# EAGLE design Zio 9DOF IMU LSM9DS1 (EAGLE 8.4.1)
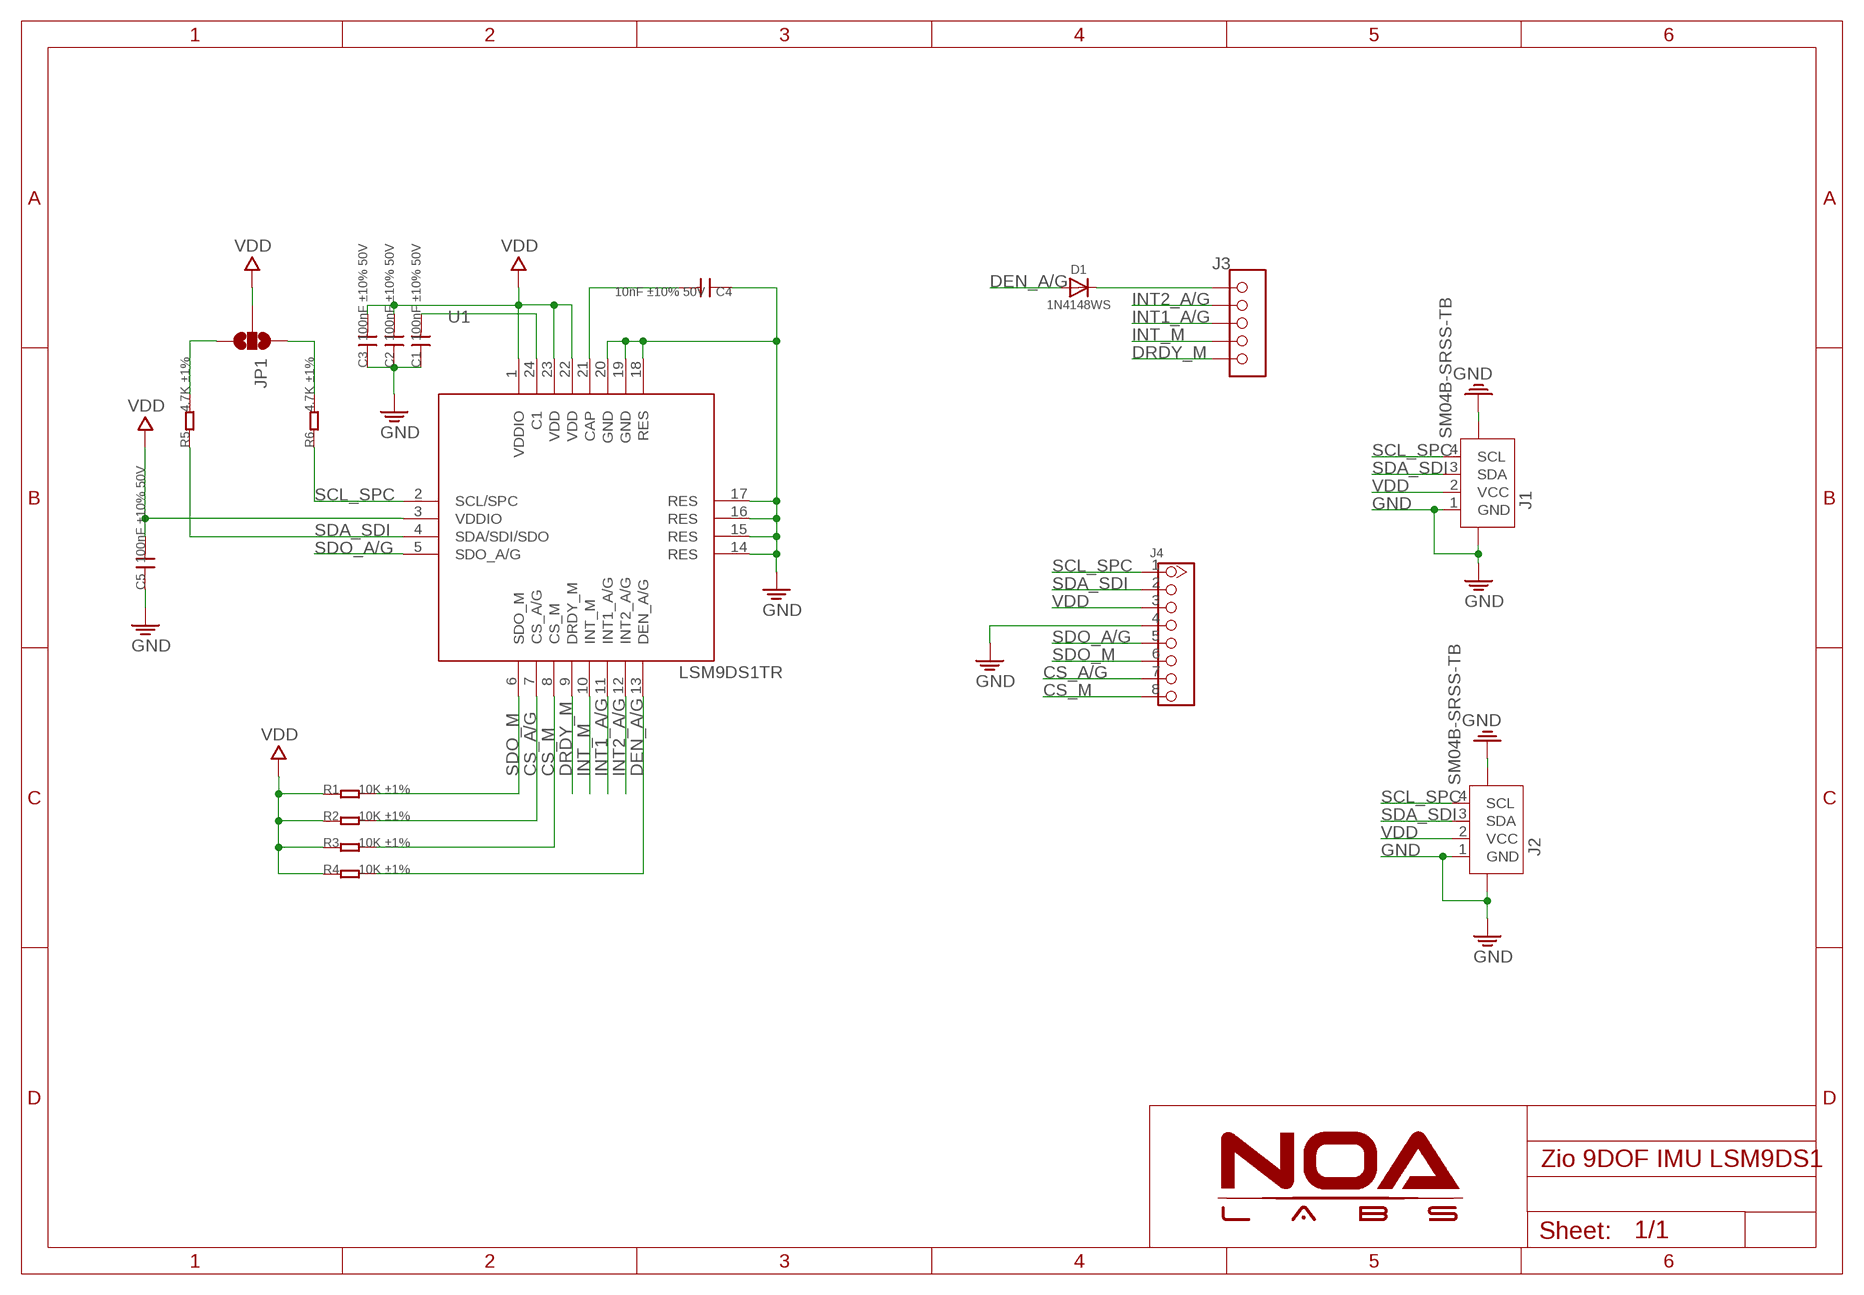
[diagram p0: schematic, sheet 1]

## Parts
C1  100nF ±10% 50V  C-0402  [0402]
C2  100nF ±10% 50V  C-0402  [0402]
C3  100nF ±10% 50V  C-0402  [0402]
C4  10nF ±10% 50V  C-0402  [0402]
C5  100nF ±10% 50V  C-0402  [0402]
D1  1N4148WS  DIODESOD-323  [SOD-323]
J1  SM04B-SRSS-TB  JST-SH-4P-1.0  [JST-SH-4P]
J2  SM04B-SRSS-TB  JST-SH-4P-1.0  [JST-SH-4P]
J3  HEADER-5P-2.54  [5P-2.54]
J4  HEADER-8P-2.54  [8P-2.54]
JP1  JUMPER-SMT_3_2-NC_PASTE_NOCREM  [SMT-JUMPER_3_2-NC_PASTE_SILK_NOCREM]
R1  10K ±1%  R-0402  [0402]
R2  10K ±1%  R-0402  [0402]
R3  10K ±1%  R-0402  [0402]
R4  10K ±1%  R-0402  [0402]
R5  4.7K ±1%  R-0402  [0402]
R6  4.7K ±1%  R-0402  [0402]
U1  LSM9DS1TR  LSM9DS1  [LGA24]

## Nets
CS_A/G: J4.7 R2.2 U1.7(CS_A/G)
CS_M: J4.8 R3.2 U1.8(CS_M)
DEN_A/G: D1.A R4.2 U1.13(DEN_A/G)
DRDY_M: J3.5 U1.9(DRDY_M)
GND: C1.1 C2.1 C3.1 C4.1 C5.1 J1.1(GND) J1.NC1 J1.NC2 J2.1(GND) J2.NC1 J2.NC2 J4.4 U1.14(RES) U1.15(RES) U1.16(RES) U1.17(RES) U1.18(RES) U1.19(GND) U1.20(GND)
INT1_A/G: J3.3 U1.11(INT1_A/G)
INT2_A/G: J3.2 U1.12(INT2_A/G)
INT_M: J3.4 U1.10(INT_M)
N$1: C1.2 U1.24(C1)
N$2: JP1.3 R5.2
N$3: JP1.1 R6.2
N$4: C4.2 U1.21(CAP)
N$5: D1.C J3.1
SCL_SPC: J1.4(SCL) J2.4(SCL) J4.1 R6.1 U1.2(SCL/SPC)
SDA_SDI: J1.3(SDA) J2.3(SDA) J4.2 R5.1 U1.4(SDA/SDI/SDO)
SDO_A/G: J4.5 U1.5(SDO_A/G)
SDO_M: J4.6 R1.2 U1.6(SDO_M)
VDD: C2.2 C3.2 C5.2 J1.2(VCC) J2.2(VCC) J4.3 JP1.2 R1.1 R2.1 R3.1 R4.1 U1.1(VDDIO) U1.3(VDDIO) U1.22(VDD) U1.23(VDD)

## Library data of the parts
C1-C5 = Discretex:C*: Ceramic Capacitors
D1 = microbuilder:DIODE: Diode SMA Model Volts Amps Type Vf Ir Digikey # Notes SSA34-E3 40V 3A Schottky 480mV @ 3A 200uA @ 40V SSA34-E3/61TGITR-ND CDBA120-G 20V 1A Schottky 500mV @ 1A 500uA @ 20V 641-1014-6-ND REEL MBRA210 10V 2A Schottky 350mV @ 2A 700uA @ 10V MBRA210LT3 SOD-123 Model Volts Amps Type Vf Ir Order # Notes BAT54T1G 30V 200mA Schottky 800mV @ 200mA 2uA @ 25V BAT54T1GOSTR-ND B0530W 30V 500mA Schottky 430mV @ 500mA 130uA @ 30V B0530W-FDICT-ND REEL MBR120 20V 1A Schottky 340mV @ 1A MBR120VLSFT1GOSCT-ND SOD-323 Model Volts Amps Type Vf Ir Order # Notes PMEG2005EJ 20V 500mA Schottky 355mV @ 500mA 568-4110-1-ND ZLLS410 10V 570mA Schottky 380mV @ 570mA ZLLS410CT-ND 1N4148WS 75V 150mA Silicon/Simple 1V 1N4148WSFSCT-ND REEL SOD-523 Model Volts Amps Type Vf Ir Order # Notes BAT54XV2 30V 200mA Schottky 0.8V @ 100mA BAT54XV2CT-ND TB751S 30V 30mA Schottky RB751S-40TE61CT-ND SOT23-R/W (R = Solder Paste/Reflow Ovens, W = Hand-Soldering) Model Volts Amps Type Vf Ir Order # Notes BAT54FILM 40V 300mA Schottky 497-7162-1-ND POWERDI-5 Model Volts Amps Type Vf Ir Order # Notes PDS560 60V 5A Schottky 670mV @ 5A 150uA @ 60V PDS560DICT-ND
J1 J2 = Connector:JST-SH-4P
J3 = Connector:HEADER-5P
J4 = Connector:HEADER-8P
JP1 = NOA-Jumpers:JUMPER-SMT_3_2-NC_PASTE_NOCREM
R1-R6 = Discretex:R*
U1 = IC:LSM9DS1

## Board
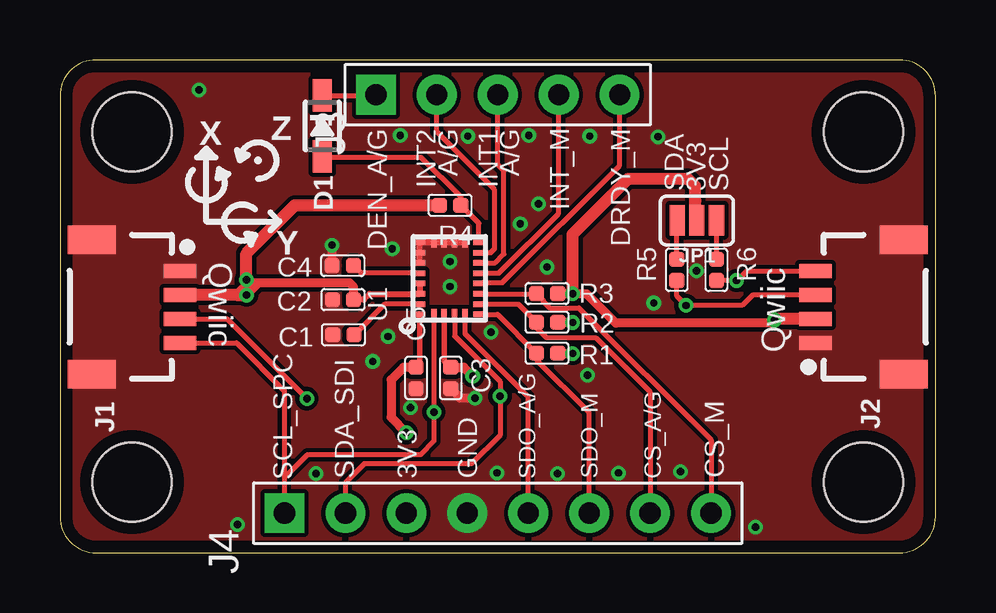
[diagram p1: board, top side]
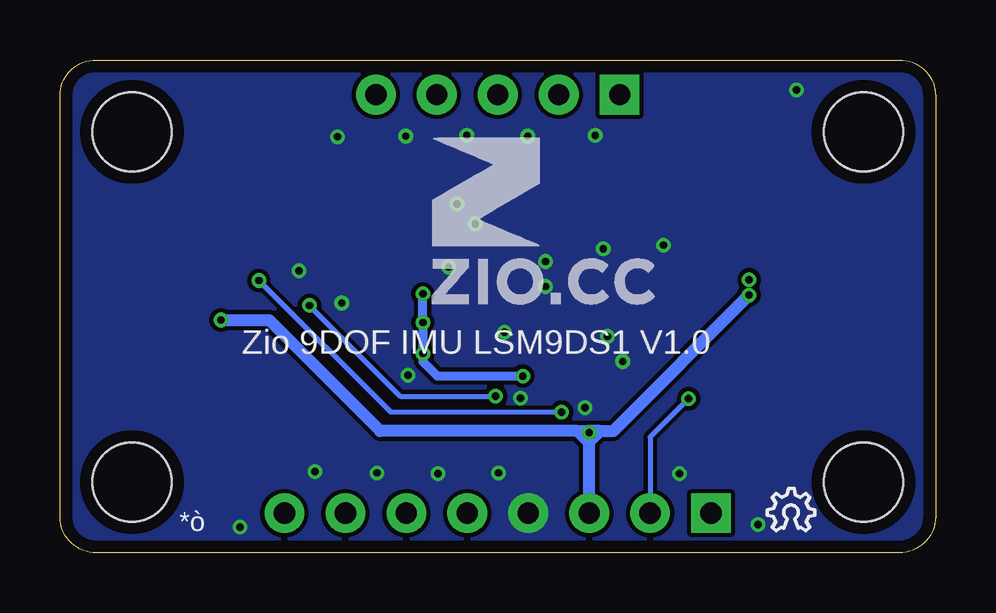
[diagram p2: board, bottom side, seen from below]

Size 36.48 x 20.55 mm. Coordinates in mm from the lower left corner, seen from the top.
Outline: 0,19.05 0,1.5 arc90 1.5,0 34.98,0 arc90 36.48,1.5 36.48,19.05 arc90 34.98,20.55 1.5,20.55 arc90 0,19.05
Copper layers (1*16): Top 0.035mm / dielectric 1.5mm / Bottom 0.035mm
Design rules "NOA Eagle Rule": minimum track width 7mil, minimum drill 12mil, track to track 7mil, track to pad 7mil, pad to pad 7mil, via to via 7mil, smd to smd 0mil, copper to edge 20mil, drill to drill 10mil, minimum pad ring 10mil, minimum via ring 6mil, stop-mask expansion 2mil, vias tented up to drill 25mil, thermal gap 10mil

### Footprints (pad centres in the part's own frame; a part is rotated, then mirrored left to right if it is on the bottom)
0402 = smd 0.635 x 0.635: 1 -0.445,0; 2 0.445,0
SOD-323 = smd 1.35 x 0.8: A 1.27,0; C -1.27,0
JST-SH-4P = smd 0.6 x 1.35: 1 1.5,0; 2 0.5,0; 3 -0.5,0; 4 -1.5,0 | smd 1.2 x 2: NC1 -2.8,3.675; NC2 2.8,3.675
5P-2.54 = drill 0.889 pad 1.651 square: 1 0,5.08 | drill 0.889 pad 1.651: 2 0,2.54; 3 0,0; 4 0,-2.54; 5 0,-5.08
8P-2.54 = drill 0.889 pad 1.651 square: 1 0,8.89 | drill 0.889 pad 1.651: 2 0,6.35; 3 0,3.81; 4 0,1.27; 5 0,-1.27; 6 0,-3.81; 7 0,-6.35; 8 0,-8.89
SMT-JUMPER_3_2-NC_PASTE_SILK_NOCREM = smd 0.635 x 1.27: 1 -0.813,0; 2 0,0; 3 0.813,0
LGA24 = smd 0.23 x 0.45: 1 -1.505,1.225; 6 -1.505,-1.225; 7 -1.075,-1.225; 8 -0.645,-1.225; 9 -0.215,-1.225; 10 0.215,-1.225; 11 0.645,-1.225; 12 1.075,-1.225; 13 1.505,-1.225; 18 1.505,1.225; 19 1.075,1.225; 20 0.645,1.225; 21 0.215,1.225; 22 -0.215,1.225; 23 -0.645,1.225; 24 -1.075,1.225 | smd 0.45 x 0.23: 2 -1.505,0.645; 3 -1.505,0.215; 4 -1.505,-0.215; 5 -1.505,-0.645; 14 1.505,-0.645; 15 1.505,-0.215; 16 1.505,0.215; 17 1.505,0.645
STAND-OFF = hole 3.302: 0,0

### Placement (x,y rotation side)
C1  11.81,9.09 0 top
C2  11.79,10.56 0 top
C3  16.28,7.29 90 top
C4  11.78,11.98 0 top
C5  14.83,7.29 90 top
D1  10.93,17.8 270 top
J1  5,10.25 90 top
J2  31.48,10.25 270 top
J3  18.24,19.1 90 top
J4  18.24,1.65 90 top
JP1  26.54,13.86 180 top
LOGO1  LOGO-OSHW-6MILX0070-NT  [OSHW_6X70_NOTEXT]  7.01,0.91 0 bottom
R1  20.29,8.32 180 top
R2  20.29,9.61 180 top
R3  20.29,10.81 180 top
R4  16.25,14.49 0 top
R5  25.7,11.8 90 top
R6  27.35,11.8 90 top
U1  16.22,11.44 90 top
U$2  [STAND-OFF]  33.48,2.95 0 top
U$11  [STAND-OFF]  3,17.55 0 top
U$12  [STAND-OFF]  33.48,17.55 0 top
U$13  [STAND-OFF]  3,2.95 0 top
U$18  [7MM]  6.18,15.1 0 bottom

### Tracks (layer width: path | path; a pad name or v marks a point on that pad's centre or on a via)
CS_A/G
  Top 0.203: U1.7 19.1,10.37 R2.2 19.85,9.39 20.27,8.97 22.32,8.97 24.59,6.7 J4.7
CS_M
  Top 0.203: U1.8 19.84,10.8 R3.2 20.14,10.52 20.14,10.47 20.4,10.21 21.62,10.21 27.13,4.7 J4.8
DEN_A/G
  Top 0.203: U1.13 17.45,13.74 R4.2 16.7,14.85 15.06,16.48 10.97,16.48 D1.A
DRDY_M
  Top 0.203: U1.9 17.48,11.26 18.43,11.26 23.32,16.15 J3.5
GND  (via drill 0.3)
  Top 0.254: U1.20 U1.19 U1.18 U1.17 U1.16 U1.15 U1.14
  Top 0.381: C3.1 16.68,6.45 v17.3,6.45 | C4.1 v11.34,12.82 v11.33,12.83
  other vias: 16.26,12.14 16.26,11.1 20.29,11.91 19.18,13.72 19.94,14.55 22.07,17.37 25.86,3.38 23.27,3.33 20.73,3.3 18.21,3.33 10.67,3.3 13.67,9.02 13.03,7.98 17.96,9.19 13.84,12.67 14.18,17.4 16.99,17.37 19.53,17.4 24.92,17.35 24.74,10.41 26.52,11.76 21.98,7.4 14.61,6.05 7.39,1.17 28.98,1.07 5.79,19.3
  pour Top (no thermals): 0,20.55 0,-0.05 36.48,-0.05 36.48,20.55
  pour Bottom (no thermals): 0,20.55 0,-0.05 36.48,-0.05 36.48,20.55
INT1_A/G
  Top 0.203: U1.11 18.13,12.09 18.49,12.45 18.49,15.93 18.24,16.18 J3.3
INT2_A/G
  Top 0.203: U1.12 17.95,12.52 18.11,12.67 18.11,15.14 15.7,17.55 J3.2
INT_M
  Top 0.203: U1.10 18.29,11.66 20.78,14.15 J3.4
N$1
  Top 0.203: U1.24 13.53,10.37 C1.2
N$2
  Top 0.203: JP1.3 25.7,13.83 R5.2
N$3
  Top 0.203: JP1.1 R6.2
N$4
  Top 0.203: U1.21 12.54,11.66 C4.2
N$5
  Top 0.203: D1.C 13.12,19.07 J3.1
SCL_SPC  (via drill 0.3)
  Top 0.203: U1.2 v15.58,5.87 15.58,4.66 15.01,4.09 10.31,4.09 9.35,3.12 | 9.35,3.12 J4.1 | J1.4 7.35,8.75 9.35,6.76 9.35,3.12 | J2.4 31.47,11.74 28.6,11.74 28.22,11.35 v28.19,11.35 R6.1
  Bottom 0.203: v28.19,11.35 22.71,5.87 v15.58,5.87
SDA_SDI  (via drill 0.3)
  Top 0.203: U1.4 16.44,9.03 18.34,7.13 v18.34,6.53 18.34,4.9 17.14,3.71 12.68,3.71 11.89,2.92 J4.2 | J1.3 6.96,9.75 v10.29,6.43 | J2.3 28.85,10.74 28.42,10.31 v26.09,10.31 25.7,10.7 R5.1
  Bottom 0.203: v10.29,6.43 11.89,4.83 J4.2 | v26.09,10.31 22.3,6.53 v18.34,6.53
SDO_A/G
  Top 0.203: U1.5 16.87,9.14 19.48,6.53 19.48,1.68 J4.5
SDO_M
  Top 0.203: U1.6 18.23,9.94 R1.2 19.85,8.04 22.02,5.87 22.02,1.68 J4.6
VDD  (via drill 0.3)
  Top 0.203: 15,7.8 C5.2
  Top 0.229: U1.1 15,7.8 | U1.3 16.01,8.01 C3.2
  Top 0.254: C2.2 12.66,10.56 12.9,10.8 U1.23 U1.22
  Top 0.381: C3.2 16.83,7.73 v17.2,7.37 | R2.1 21.35,9.61 v21.36,9.6 | R3.1 v21.35,10.81 v21.36,10.8 21.95,10.8 23.16,9.58 29.64,9.58 v29.77,9.7 | R1.1 v21.35,8.32 v21.36,8.31 | C2.2 12.24,11.08 12.06,11.25 8.27,11.25 | 8.27,11.25 v7.77,10.75 | 8.27,11.25 7.89,11.25 v7.77,11.38 v7.77,11.37 v7.77,10.74 | 7.77,11.13 7.72,11.13 7.34,10.75 | C5.2 14.31,7.73 13.79,7.21 13.79,5.64 v14.43,5.01
  Top 0.508: v21.36,10.8 21.36,13.28 23.67,15.6 26.16,15.6 26.47,15.29 26.47,14.68 26.47,14.67 26.47,13.92 JP1.2 | J2.2 29.82,9.75 v29.77,9.7 | v7.77,10.75 7.34,10.75 J1.2 | v7.77,10.75 v7.77,10.74 | R4.1 15.8,14.48 9.78,14.48 7.77,12.47 v7.77,11.38 7.77,11.13 v7.77,10.75
  Bottom 0.381: v21.36,10.8 v21.36,9.6 v21.36,8.31 21.36,7.98 20.75,7.37 v17.2,7.37
  Bottom 0.508: v29.77,9.7 27.76,9.7 23.14,5.08 14.94,5.08 | 13.97,5.08 14.5,5.08 | 13.97,5.08 13.44,5.08 v7.77,10.74 | 14.94,5.08 14.5,5.08 | J4.3 14.43,4.57 | 14.43,4.62 v14.43,5.01 14.5,5.08 | 14.43,4.57 14.43,4.62 | 14.43,4.62 13.97,5.08 | 14.43,4.57 14.94,5.08

### Text on the board
tPlace: DEN_A/G | INT2 | A/G | INT1 | A/G | INT_M | DRDY_M | X | Z | SDA | 3V3 | SCL | Qwiic | Y | Qwiic | SCL_SPC | SDA_SDI | 3V3 | GND | SDO_A/G | SDO_M | CS_A/G | CS_M
bPlace: Zio 9DOF IMU LSM9DS1 V1.0 | *ò